# Altium schematic sheet Step1807301316.SchDoc
size A3
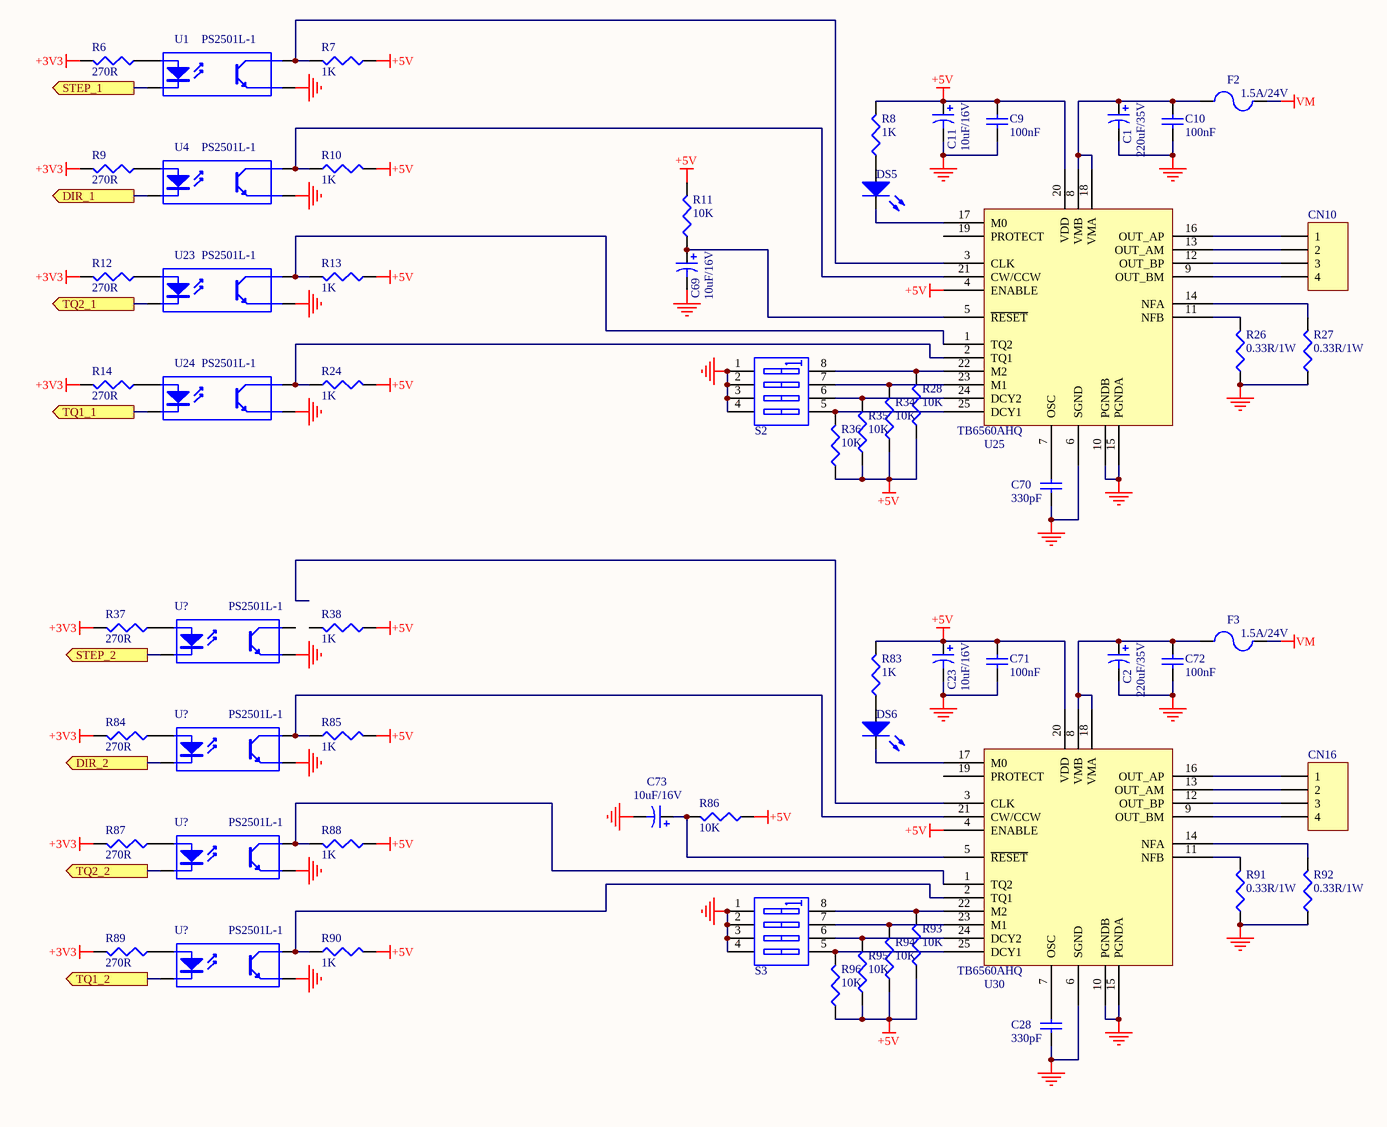
[diagram p0: Step1807301316.SchDoc]

## Parts
(Parts that share a designator on the sheet are numbered #1, #2 ... from top to bottom, then left to right.)
C1  220uF/35V  [CAP-D10/L13]
C2  220uF/35V  [CAP-D10/L13]
C9  100nF  [C0603-3]
C10  100nF  [C0603-3]
C11  10uF/16V  [CE1210]
C23  10uF/16V  [CE1210]
C28  330pF  [C0603-3]
C69  10uF/16V  [CE1210]
C70  330pF  [C0603-3]
C71  100nF  [C0603-3]
C72  100nF  [C0603-3]
C73  10uF/16V  [CE1210]
CN10  (no value)  [XHS4-2.5]
CN16  (no value)  [XHS4-2.5]
DS5  (no value)  [LED-0805]
DS6  (no value)  [LED-0805]
F2  1.5A/24V  [1812]
F3  1.5A/24V  [1812]
R6  270R  [R0603-3]
R7  1K  [R0603-3]
R8  1K  [R0603-3]
R9  270R  [R0603-3]
R10  1K  [R0603-3]
R11  10K  [R0603-3]
R12  270R  [R0603-3]
R13  1K  [R0603-3]
R14  270R  [R0603-3]
R24  1K  [R0603-3]
R26  0.33R/1W  [2512]
R27  0.33R/1W  [2512]
R28  10K  [R0603-3]
R34  10K  [R0603-3]
R35  10K  [R0603-3]
R36  10K  [R0603-3]
R37  270R  [R0603-3]
R38  1K  [R0603-3]
R83  1K  [R0603-3]
R84  270R  [R0603-3]
R85  1K  [R0603-3]
R86  10K  [R0603-3]
R87  270R  [R0603-3]
R88  1K  [R0603-3]
R89  270R  [R0603-3]
R90  1K  [R0603-3]
R91  0.33R/1W  [2512]
R92  0.33R/1W  [2512]
R93  10K  [R0603-3]
R94  10K  [R0603-3]
R95  10K  [R0603-3]
R96  10K  [R0603-3]
S2  (no value)  [SDSW8-H]
S3  (no value)  [SDSW8-H]
U1  PS2501L-1  [SOP4-2.54]
U4  PS2501L-1  [SOP4-2.54]
U23  PS2501L-1  [SOP4-2.54]
U24  PS2501L-1  [SOP4-2.54]
U25  TB6560AHQ  [HZIP25-P-1.27]
U30  TB6560AHQ  [HZIP25-P-1.27]
U?#1  PS2501L-1  [SOP4-2.54]
U?#2  PS2501L-1  [SOP4-2.54]
U?#3  PS2501L-1  [SOP4-2.54]
U?#4  PS2501L-1  [SOP4-2.54]

## Ports
DIR_1 (out), DIR_2 (out), STEP_1 (out), STEP_2 (out), TQ1_1 (out), TQ1_2 (out), TQ2_1 (out), TQ2_2 (out)

## Nets
+3V3: R6.2 R9.2 R12.2 R14.2 R37.2 R84.2 R87.2 R89.2
+5V: C9.1 C11.1 C23.1 C71.1 R7.1 R8.2 R10.2 R11.2 R13.1 R24.2 R28.1 R34.1 R35.1 R36.1 R38.1 R83.2 R85.2 R86.1 R88.1 R90.2 R93.1 R94.1 R95.1 R96.1 U25.4(ENABLE) U25.20(VDD) U30.4(ENABLE) U30.20(VDD)
GND: C1.2 C2.2 C9.2 C10.2 C11.2 C23.2 C28.2 C69.2 C70.2 C71.2 C72.2 C73.2 R26.1 R27.1 R91.1 R92.1 S2.1(A1) S2.2(A2) S2.3(A3) S2.4(A4) S3.1(A1) S3.2(A2) S3.3(A3) S3.4(A4) U1.3(C) U4.3(C) U23.3(C) U24.3(C) U25.6(SGND) U25.10(PGNDB) U25.15(PGNDA) U30.6(SGND) U30.10(PGNDB) U30.15(PGNDA) U?#1.3(E) U?#2.3(E) U?#3.3(E) U?#4.3(E)
VM: F2.2 F3.2
DIR_1: U4.2(K) ; port DIR_1
DIR_2: U?#2.2(K) ; port DIR_2
STEP_1: U1.2(K) ; port STEP_1
STEP_2: U?#1.2(K) ; port STEP_2
TQ1_1: U24.2(K) ; port TQ1_1
TQ1_2: U?#4.2(K) ; port TQ1_2
TQ2_1: U23.2(K) ; port TQ2_1
TQ2_2: U?#3.2(K) ; port TQ2_2
NetC1_1: C1.1 C10.1 F2.1 U25.8(VMB) U25.18(VMA)
NetC2_1: C2.1 C72.1 F3.1 U30.8(VMB) U30.18(VMA)
NetC28_1: C28.1 U30.7(OSC)
NetC69_1: C69.1 R11.1 U25.5(~{RESET})
NetC70_1: C70.1 U25.7(OSC)
NetC73_1: C73.1 R86.2 U30.5(~{RESET})
NetCN10_1: CN10.1 U25.16(OUT_AP)
NetCN10_2: CN10.2 U25.13(OUT_AM)
NetCN10_3: CN10.3 U25.12(OUT_BP)
NetCN10_4: CN10.4 U25.9(OUT_BM)
NetCN16_1: CN16.1 U30.16(OUT_AP)
NetCN16_2: CN16.2 U30.13(OUT_AM)
NetCN16_3: CN16.3 U30.12(OUT_BP)
NetCN16_4: CN16.4 U30.9(OUT_BM)
NetDS5_1: DS5.1(A) R8.1
NetDS5_2: DS5.2(K) U25.17(M0)
NetDS6_1: DS6.1(A) R83.1
NetDS6_2: DS6.2(K) U30.17(M0)
NetR6_1: R6.1 U1.1(A)
NetR7_2: R7.2 U1.4(D) U25.3(CLK)
NetR9_1: R9.1 U4.1(A)
NetR10_1: R10.1 U4.4(D) U25.21(CW/CCW)
NetR12_1: R12.1 U23.1(A)
NetR13_2: R13.2 U23.4(D) U25.1(TQ2)
NetR14_1: R14.1 U24.1(A)
NetR24_1: R24.1 U24.4(D) U25.2(TQ1)
NetR26_2: R26.2 U25.11(NFB)
NetR27_2: R27.2 U25.14(NFA)
NetR28_2: R28.2 S2.8(B1) U25.22(M2)
NetR34_2: R34.2 S2.7(B2) U25.23(M1)
NetR35_2: R35.2 S2.6(B3) U25.24(DCY2)
NetR36_2: R36.2 S2.5(B4) U25.25(DCY1)
NetR37_1: R37.1 U?#1.1(A)
NetR84_1: R84.1 U?#2.1(A)
NetR85_1: R85.1 U30.21(CW/CCW) U?#2.4(C)
NetR87_1: R87.1 U?#3.1(A)
NetR88_2: R88.2 U30.1(TQ2) U?#3.4(C)
NetR89_1: R89.1 U?#4.1(A)
NetR90_1: R90.1 U30.2(TQ1) U?#4.4(C)
NetR91_2: R91.2 U30.11(NFB)
NetR92_2: R92.2 U30.14(NFA)
NetR93_2: R93.2 S3.8(B1) U30.22(M2)
NetR94_2: R94.2 S3.7(B2) U30.23(M1)
NetR95_2: R95.2 S3.6(B3) U30.24(DCY2)
NetR96_2: R96.2 S3.5(B4) U30.25(DCY1)

Not connected (* = marked no-connect by the designer): R38 2; U25 19(PROTECT); U30 3(CLK) 19(PROTECT); U?#1 4(C)

## Library data of the parts
C1 C2 C11 C23 C69 C73 = Cap Pol1: Polarized Capacitor (Radial); Value: 100pF; Published: 8-Jun-2000; LatestRevisionDate: 17-Jul-2002; LatestRevisionNote: Re-released for DXP Platform.; PackageReference: RB7.6-15; Publisher: Altium Limited; PackageDescription: Polarized Capacitor (Radial); 2 Leads
C9 C10 C28 C70-C72 = Cap: Capacitor; Value: 100pF; Published: 8-Jun-2000; LatestRevisionDate: 17-Jul-2002; LatestRevisionNote: Re-released for DXP Platform.; PackageReference: RAD-0.3; Publisher: Altium Limited; PackageDescription: Radial Cap, Thru-Hole; 2 Leads; 0.3 in Pin Spacing
CN10 CN16 = Header 4: Header, 4-Pin; LatestRevisionDate: 17-Jul-2002; LatestRevisionNote: Re-released for DXP Platform.; Publisher: Altium Limited
DS5 DS6 = LED0: Typical INFRARED GaAs LED; Published: 8-Jun-2000; LatestRevisionDate: 08-Jul-2005; LatestRevisionNote: Mech Layer 1 removed.; PackageReference: LED-0; Publisher: Altium Limited; PackageDescription: LED; 2 Leads
F2 F3 = Fuse 2
R6 R9 R11 R12 R14 R26-R28 R34-R37 R84 R86 R87 R89 R91-R96 = Res3: Resistor; Value: 1K; Published: 8-Jun-2000; LatestRevisionDate: 29-May-2009; LatestRevisionNote: IPC-7351 Footprint Added.; PackageReference: J1-0603; Publisher: Altium Limited; PackageDescription: Chip Resistor
R7 R8 R10 R13 R24 R38 R83 R85 R88 R90 = Res3: Resistor; Published: 8-Jun-2000; LatestRevisionDate: 29-May-2009; LatestRevisionNote: IPC-7351 Footprint Added.; PackageReference: J1-0603; Publisher: Altium Limited; PackageDescription: Chip Resistor; Value: 1K
S2 S3 = SW DIP-4: DIP Switch, 4 Position, SPST; Published: 24-Mar-1999; LatestRevisionDate: 29-May-2009; LatestRevisionNote: IPC-7351 Footprint Added.; PackageVersion: Dec-2002; PackageReference: SO8; Publisher: Altium Limited; PackageDescription: 8-Pin Small Outline Integrated Circuit 1.27 mm Pitch; Code_JEDEC: MS-012-AA; Code_IPC: SOIC127P600-8
U1 U4 U23 U24 = PC187
U25 U30 = TB6560AHQ: PWM Chopper-Type Bipolar Driver IC for Stepping Motor Control
U?#1-U?#4 = Optoisolator1: 4-Pin Phototransistor Optocoupler; Published: 24-Mar-1999; LatestRevisionDate: 04-Mar-2005; LatestRevisionNote: Sch pins 3 & 4 Swapped.; DatasheetVersion: Nov-2003; PackageReference: DIP-4; Publisher: Altium Limited